# Altium schematic sheet VCA.SchDoc
size A2
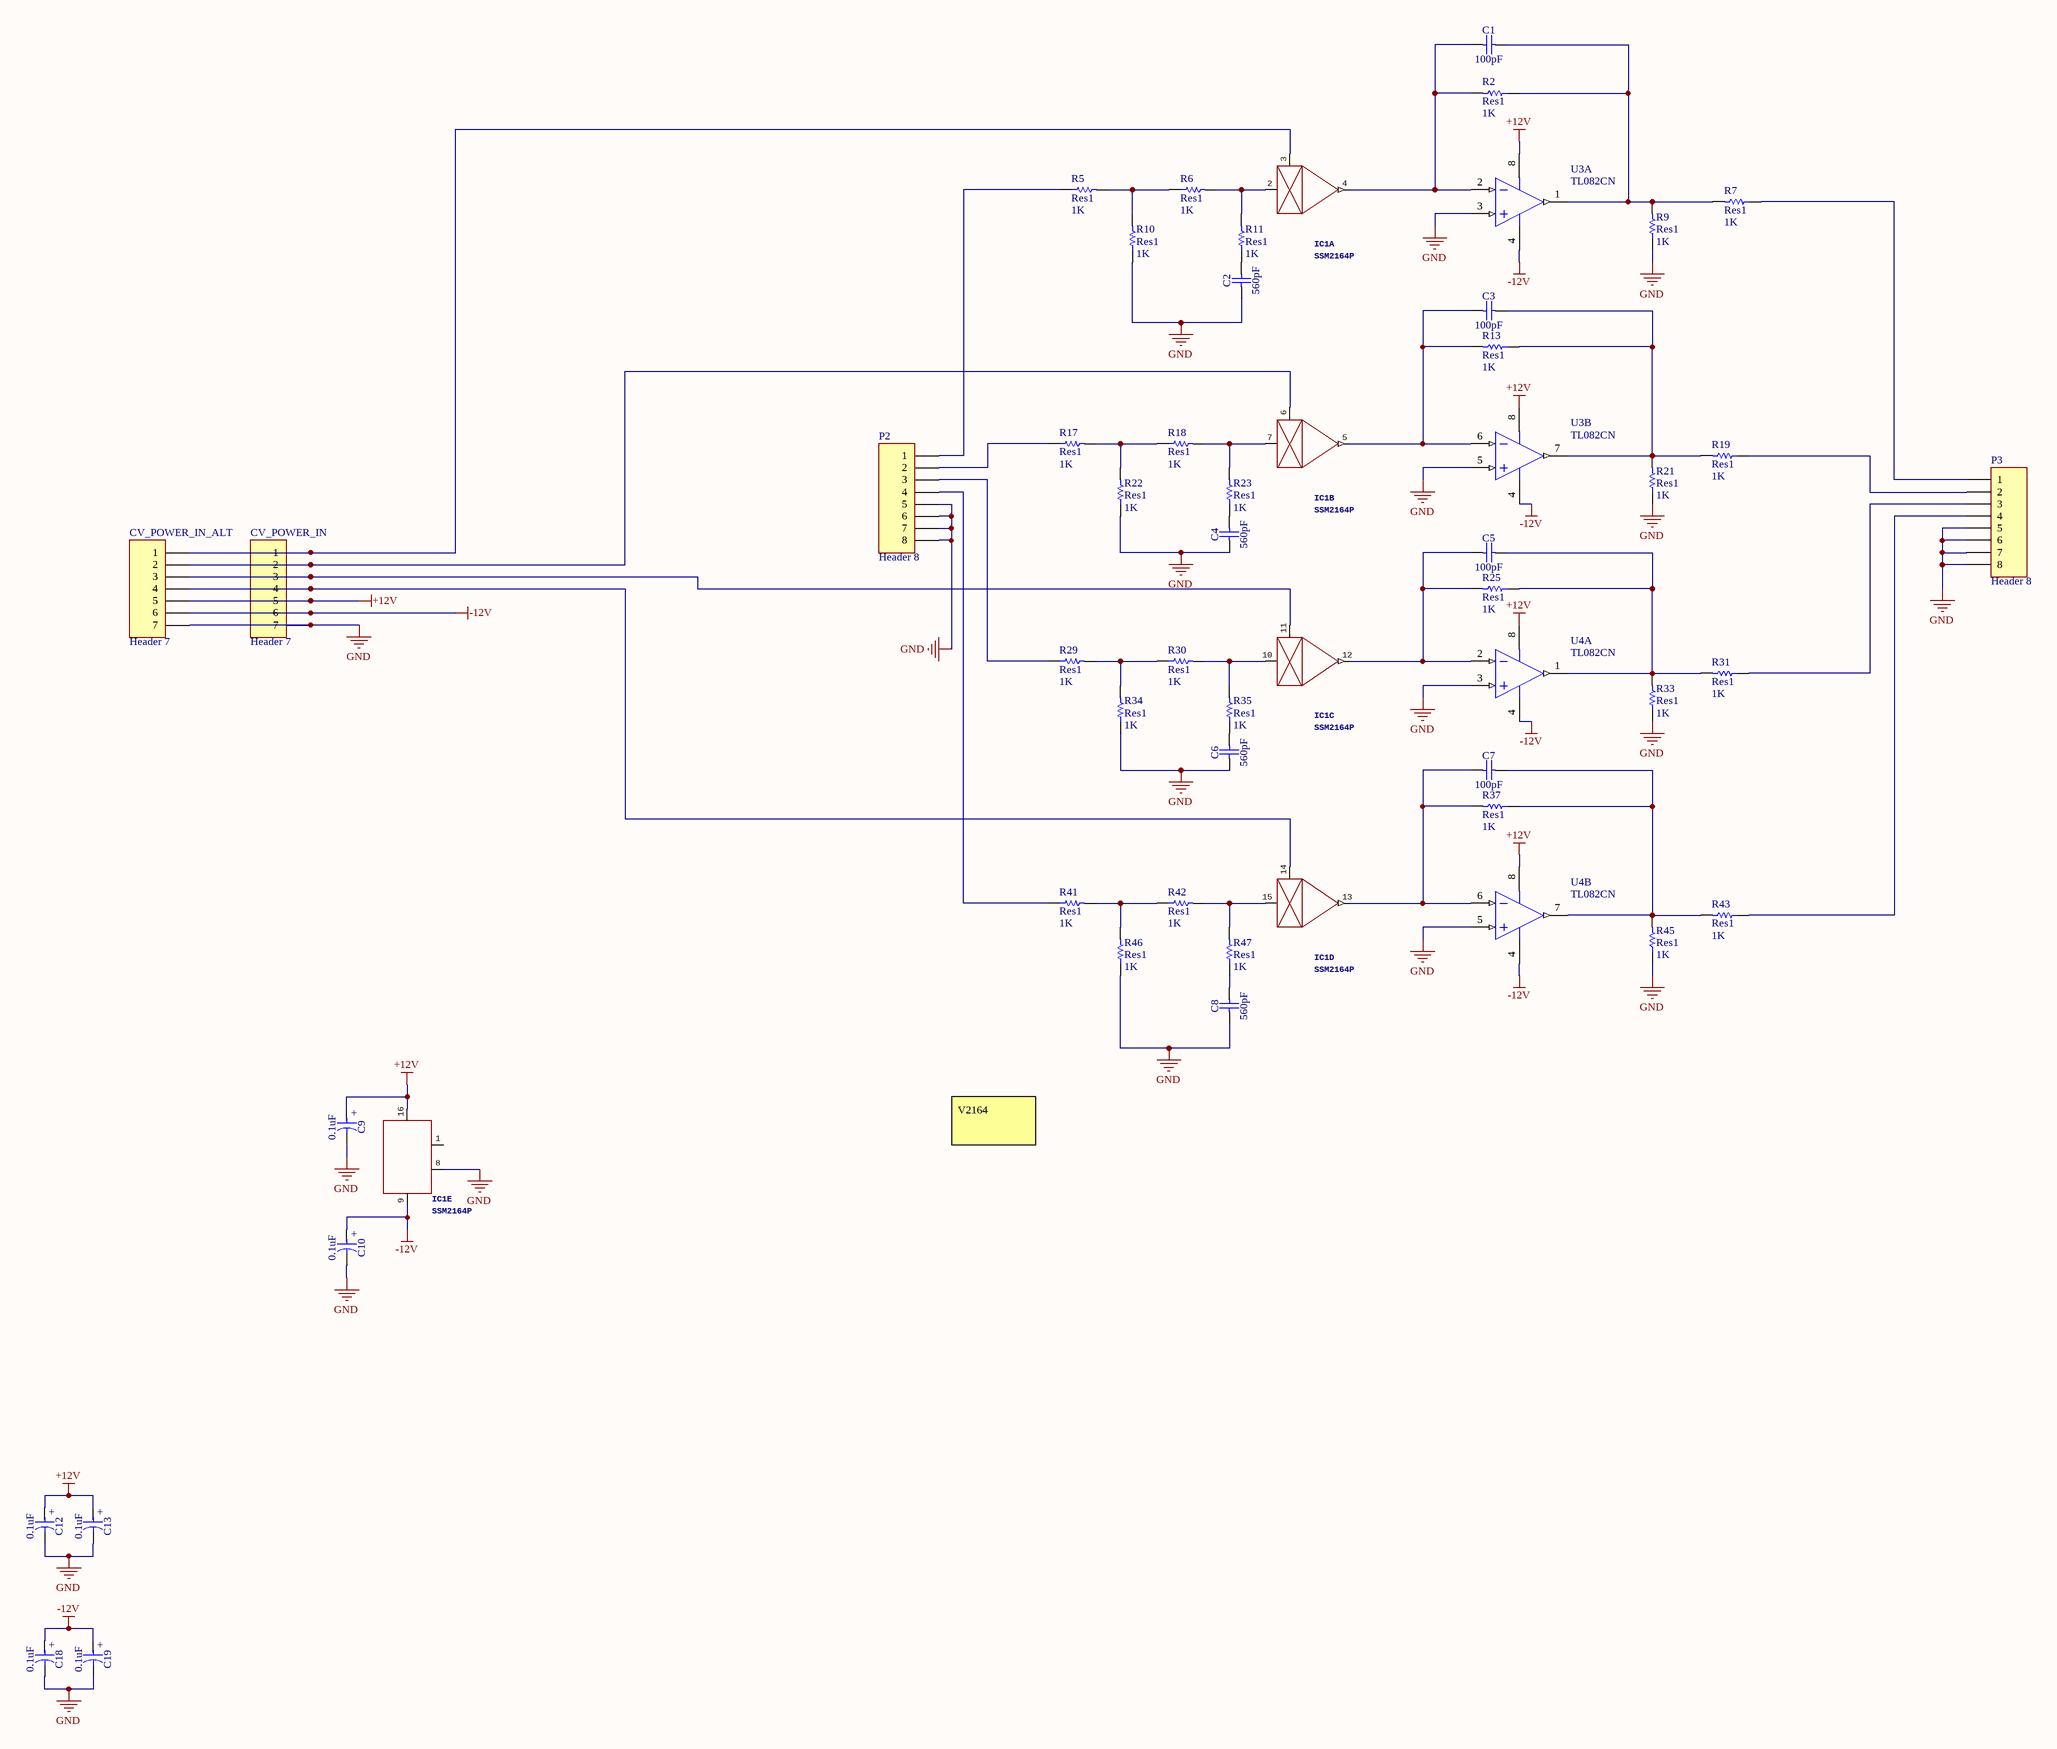
[diagram p0: VCA.SchDoc]

## Parts
C1  100pF  [CAPRR508-254X381X584]
C2  560pF  [CAPRR254-254X381X381]
C3  100pF  [CAPRR508-254X381X584]
C4  560pF  [CAPRR254-254X381X381]
C5  100pF  [CAPRR508-254X381X584]
C6  560pF  [CAPRR254-254X381X381]
C7  100pF  [CAPRR508-254X381X584]
C8  560pF  [CAPRR254-254X381X381]
C9  0.1uF  [CAPPRB508-450x850]
C10  0.1uF  [CAPPRB508-450x850]
C12  0.1uF  [CAPPRB508-450x850]
C13  0.1uF  [CAPPRB508-450x850]
C18  0.1uF  [CAPPRB508-450x850]
C19  0.1uF  [CAPPRB508-450x850]
CV_POWER_IN  Header 7  [HDR1X7]
CV_POWER_IN_ALT  Header 7  [HDR1X7]
IC1  SSM2164P  [DIL16]  (parts A,B,C,D,E of 5)
P2  Header 8  [HDR1X8]
P3  Header 8  [HDR1X8]
R2  Res1  value 1K  [0207/2V]
R5  Res1  value 1K  [0207/2V]
R6  Res1  value 1K  [0207/2V]
R7  Res1  value 1K  [0207/2V]
R9  Res1  value 1K  [0207/2V]
R10  Res1  value 1K  [0207/2V]
R11  Res1  value 1K  [0207/2V]
R13  Res1  value 1K  [0207/2V]
R17  Res1  value 1K  [0207/2V]
R18  Res1  value 1K  [0207/2V]
R19  Res1  value 1K  [0207/2V]
R21  Res1  value 1K  [0207/2V]
R22  Res1  value 1K  [0207/2V]
R23  Res1  value 1K  [0207/2V]
R25  Res1  value 1K  [0207/2V]
R29  Res1  value 1K  [0207/2V]
R30  Res1  value 1K  [0207/2V]
R31  Res1  value 1K  [0207/2V]
R33  Res1  value 1K  [0207/2V]
R34  Res1  value 1K  [0207/2V]
R35  Res1  value 1K  [0207/2V]
R37  Res1  value 1K  [0207/2V]
R41  Res1  value 1K  [0207/2V]
R42  Res1  value 1K  [0207/2V]
R43  Res1  value 1K  [0207/2V]
R45  Res1  value 1K  [0207/2V]
R46  Res1  value 1K  [0207/2V]
R47  Res1  value 1K  [0207/2V]
U3  TL082CN  [STM-N8]  (parts A,B of 2)
U4  TL082CN  [STM-N8]  (parts A,B of 2)

## Nets
+12V: C9.1 C12.1 C13.1 CV_POWER_IN.5 CV_POWER_IN_ALT.5 IC1.16(V+) U3.8(VCC+) U4.8(VCC+)
-12V: C10.1 C18.1 C19.1 CV_POWER_IN.6 CV_POWER_IN_ALT.6 IC1.9(V-) U3.4(VCC-) U4.4(VCC-)
GND: C2.1 C4.1 C6.1 C8.1 C9.2 C10.2 C12.2 C13.2 C18.2 C19.2 CV_POWER_IN.7 CV_POWER_IN_ALT.7 IC1.8(GND) P2.5 P2.6 P2.7 P2.8 P3.5 P3.6 P3.7 P3.8 R9.1 R10.1 R21.1 R22.1 R33.1 R34.1 R45.1 R46.1 U3.3(IN1+) U3.5(IN2+) U4.3(IN1+) U4.5(IN2+)
NetC1_1: C1.1 IC1.4(OUT) R2.2 U3.2(IN1-)
NetC1_2: C1.2 R2.1 R7.2 R9.2 U3.1(OUT1)
NetC2_2: C2.2 R11.1
NetC3_1: C3.1 IC1.5(OUT) R13.2 U3.6(IN2-)
NetC3_2: C3.2 R13.1 R19.2 R21.2 U3.7(OUT2)
NetC4_2: C4.2 R23.1
NetC5_1: C5.1 IC1.12(OUT) R25.2 U4.2(IN1-)
NetC5_2: C5.2 R25.1 R31.2 R33.2 U4.1(OUT1)
NetC6_2: C6.2 R35.1
NetC7_1: C7.1 IC1.13(OUT) R37.2 U4.6(IN2-)
NetC7_2: C7.2 R37.1 R43.2 R45.2 U4.7(OUT2)
NetC8_2: C8.2 R47.1
NetCV_POWER_IN_1: CV_POWER_IN.1 CV_POWER_IN_ALT.1 IC1.3(CTRL)
NetCV_POWER_IN_2: CV_POWER_IN.2 CV_POWER_IN_ALT.2 IC1.6(CTRL)
NetCV_POWER_IN_3: CV_POWER_IN.3 CV_POWER_IN_ALT.3 IC1.11(CTRL)
NetCV_POWER_IN_4: CV_POWER_IN.4 CV_POWER_IN_ALT.4 IC1.14(CTRL)
NetIC1_2: IC1.2(IN) R6.2 R11.2
NetIC1_7: IC1.7(IN) R18.2 R23.2
NetIC1_10: IC1.10(IN) R30.2 R35.2
NetIC1_15: IC1.15(IN) R42.2 R47.2
NetP2_1: P2.1 R5.1
NetP2_2: P2.2 R17.1
NetP2_3: P2.3 R29.1
NetP2_4: P2.4 R41.1
NetP3_1: P3.1 R7.1
NetP3_2: P3.2 R19.1
NetP3_3: P3.3 R31.1
NetP3_4: P3.4 R43.1
NetR5_2: R5.2 R6.1 R10.2
NetR17_2: R17.2 R18.1 R22.2
NetR29_2: R29.2 R30.1 R34.2
NetR41_2: R41.2 R42.1 R46.2

Not connected (* = marked no-connect by the designer): IC1 1(MODE)

## Notes on the sheet
- V2164
- Title
- Size:
- Date:
- File:
- A2
- Number:
- Time:
- Revision:
- Sheet
- of
- (in symbol CTEB_0.1UF_35V_10%_508-450X850) +

## Library data of the parts
C1 C3 C5 C7 = CCR_100PF_100V_5%_C0G_508-254X381X584: Non-polarised capacitor; Part Description: Radial Lead Type Multilayer Ceramic Capacitor; Manufacturer: GENERIC; Manufacturer1 Part Number: C317C101J1G5TA; Voltage: 100VDC; TC: C0G; Tolerance: ±5%; Part Number: CCR_100PF_100V_5%_C0G_508-254X381X584; Component Kind: Standard; Component Type: Standard; Pin Count: 2; Value: 100pF; Status: None; Manufacturer Part Number: CCR_100PF_100V_5%_C0G_508-254X381X584; Case: LS5.08 W2.54 x L3.81 x H5.84; Mounted: Yes; Socket: No; SMD: No; Sense: No; ComponentHeight: 5.84mm; Manufacturer1 Example: KEMET; Manufacturer1 ComponentHeight: 5.84mm; HelpURL: \\cern.ch\dfs\Applications\Altium\Datasheets\CCR_KEMET_C317.pdf; Author: CERN DEM JLC; CreateDate: 17/12/2008; LatestRevisionDate: 16/04/2015
C2 C4 C6 C8 = CCR_560PF_100V_5%_C0G_254-254X381X381: Non-polarised capacitor; Part Description: Radial Lead Type Multilayer Ceramic Capacitor; Manufacturer: AVX; Manufacturer Part Number: SR151A561JAA; Voltage: 100VDC; TC: C0G; Tolerance: ±5%; Part Number: CCR_560PF_100V_5%_C0G_254-254X381X381; Component Kind: Standard; Component Type: Standard; Pin Count: 2; Value: 560pF; Status: None; Case: LS2.54 W2.54 x L3.81 x H3.81; Mounted: Yes; Socket: No; SMD: No; Sense: No; ComponentHeight: 3.81mm; HelpURL: \\cern.ch\dfs\Applications\Altium\Datasheets\CCR_AVX_SR15.pdf; Author: CERN DEM JLC; CreateDate: 17/11/2010; LatestRevisionDate: 16/04/2015
C9 C10 C12 C13 C18 C19 = CTEB_0.1UF_35V_10%_508-450X850: Polarised capacitor; Part Description: Solid Tantalum Resin Dipped Capacitor; Manufacturer: AVX; Manufacturer Part Number: TAP104M035CCS-LF; Voltage: 35V; Tolerance: ±10%; Part Number: CTEB_0.1UF_35V_10%_508-450X850; Component Kind: Standard; Component Type: Standard; Pin Count: 2; Value: 0.1uF; Status: None; Case: LS5.08 D4.5 x H8.5; Mounted: Yes; Socket: No; SMD: No; Sense: No; ComponentHeight: 8.5mm; HelpURL: \\cern.ch\dfs\Applications\Altium\Datasheets\CTEB_AVX_TAP.pdf; Author: CERN DEM JLC; CreateDate: 19/08/2010; LatestRevisionDate: 19/08/2010
CV_POWER_IN CV_POWER_IN_ALT = Header 7: Header, 7-Pin; System: Connector; LatestRevisionDate: 17-Jul-2002; LatestRevisionNote: Re-released for DXP Platform.
  CV_POWER_IN: Publisher: Altium Limited
IC1 = SSM2164P: GateName_1: A; SymbolName_1: GAINCELL; GateName_2: B; GateName_3: C; GateName_4: D; GateName_5: E; SymbolName_5: VCCBLK; DeviceName: P; SymbolName_2: GAINCELL; SymbolName_3: GAINCELL; SymbolName_4: GAINCELL; LibraryName: ssm2164_2; DeviceSetName: SSM2164; Package: DIL16
P2 P3 = Header 8: Header, 8-Pin; LatestRevisionDate: 17-Jul-2002; LatestRevisionNote: Re-released for DXP Platform.; Publisher: Altium Limited
R2 R5-R7 R9-R11 R13 R17-R19 R21-R23 R25 R29-R31 R33-R35 R37 R41-R43 R45-R47 = Res1: Resistor; Published: 8-Jun-2000; LatestRevisionDate: 17-Jul-2002; LatestRevisionNote: Re-released for DXP Platform.; PackageReference: AXIAL-0.3; Publisher: Altium Limited; PackageDescription: Axial Device, Thru-Hole; 2 Leads; 0.3 in Pin Spacing
U3 U4 = CMP-2000-07247-1: General Purpose JFET Dual Operational Amplifier, 4 MHz, 6 to 36 V, 0 to 70 degC, 8-Pin DIP (N8), RoHS, Tube; Manufacturer: STMicroelectronics; Manufacturer Type: GeneralPurposeAmplifier; Number of Channels per Chip: 2; Typical Dual Supply Voltage: 5V; Maximum Input Offset Voltage: 10mV@15V; Typical Slew Rate: 16V/us@15V; Rail to Rail: No; Maximum Dual Supply Voltage: 18V; Minimum CMRR: 70dB; Maximum Supply Current: 2.5mA@15V; Typical Input Noise Voltage Density: 15nV/rtHz@15V; Pin_Count: 8; Minimum Dual Supply Voltage: 3V; Maximum Power Dissipation: 680mW; Product Height: 3.3mm; Typical Voltage Gain: 106.02dB; Typical Gain Bandwidth Product: 4MHz; Maximum Input Bias Current: 0.0004uA@15V; Product Length: 9.27mm; Product Width: 6.35mm; Power Supply Type: Dual; Package Description: 8-Pin Double In-line Package, Body 9.59 x 6.605 mm, Pitch 2.54 mm; Datasheet Version: Rev. 10, 06/2008; Shut Down Support: No; Package Reference: N8; Mounting Technology: ThroughHole; Maximum Operating Temperature: 70C; Type: GeneralPurposeAmplifier; Manufacturer URL: http://www.st.com/; Mounting: ThroughHole; Minimum Operating Temperature: 0C; Supplier_Package: PDIP; Family: TL082; Technology: BiFET; Product Type: OPAmp; Packaging: Tube; Datasheet URL: https://datasheet.ciiva.com/19471/2002077-19471009.pdf; PartId: 1